# Altium schematic sheet structure.SchDoc
size 420 x 297 mm
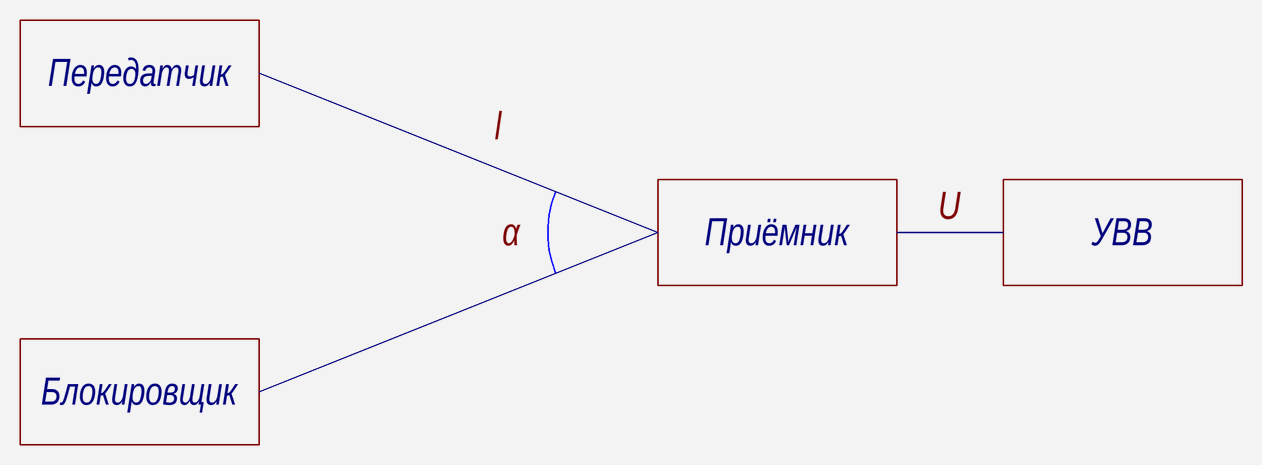
[diagram p0: structure.SchDoc]

## Notes on the sheet
- Передатчик
- l
- α
- Приёмник
- U
- УВВ
- Блокировщик
- Перв. примен.
- Справ. №
- Подп. и дата
- Инв. № дубл.
- Взам. инв. №
- Разраб.
- Изм.
- Лист
- № докум.
- Подп.
- Дата
- Лит.
- Масса
- Масштаб
- Пров.
- Т. контр.
- Листов
- Инв. № подл.
- Н. контр.
- Утв.
- Копировал
- Формат А3